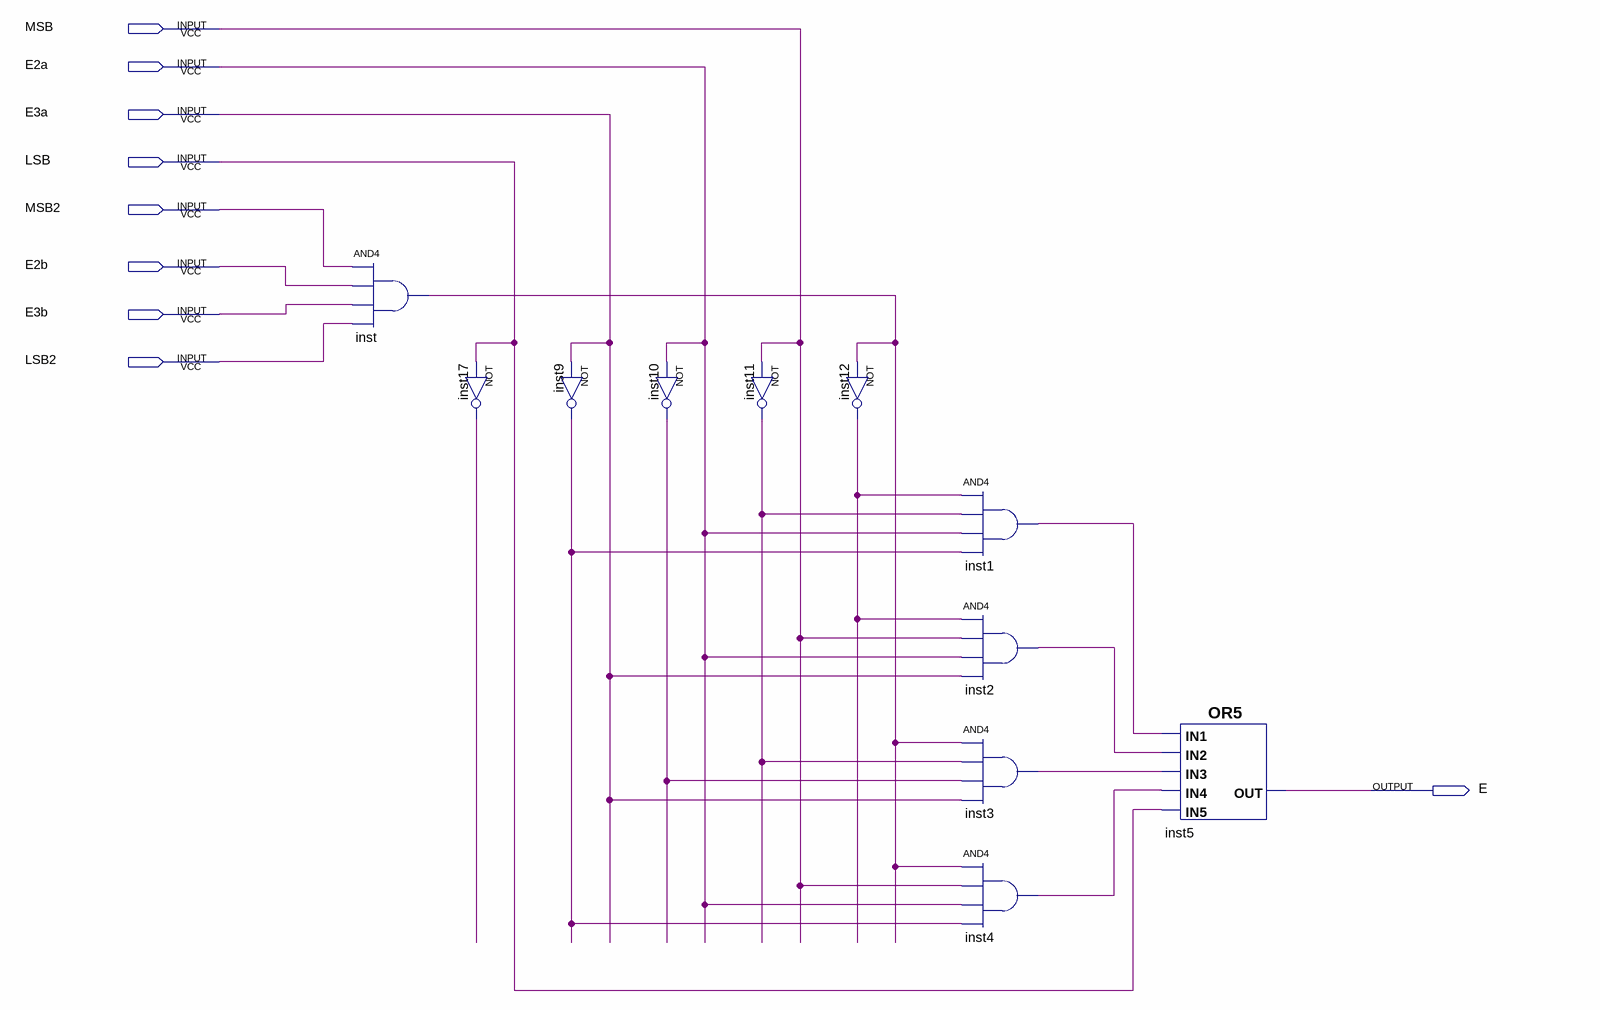
[diagram p0: schematic sheet]
// Quartus schematic decodificadorSomaUnidadeSaidaE.bdf as structural Verilog: 11 symbols, 9 pins
module decodificadorSomaUnidadeSaidaE (
  input  MSB,
  input  E2a,
  input  E3a,
  input  LSB,
  input  MSB2,
  input  E2b,
  input  E3b,
  input  LSB2,
  output E
);

  wire inst1_out, inst2_out, inst3_out, inst4_out, inst9_out, inst10_out, inst11_out, inst12_out, inst17_out,
       inst_out;

  and inst (inst_out, MSB2, E2b, E3b, LSB2);
  not inst17 (inst17_out, LSB);
  not inst9 (inst9_out, E3a);
  not inst10 (inst10_out, E2a);
  not inst11 (inst11_out, MSB);
  not inst12 (inst12_out, inst_out);
  and inst1 (inst1_out, inst12_out, inst11_out, E2a, inst9_out);
  and inst2 (inst2_out, inst12_out, MSB, E2a, E3a);
  and inst3 (inst3_out, inst_out, inst11_out, inst10_out, E3a);
  and inst4 (inst4_out, inst_out, MSB, E2a, inst9_out);
  or inst5 (E, inst1_out, inst2_out, inst3_out, inst4_out, LSB);
endmodule
